# Altium schematic sheet LDO_3V3.SchDoc
size A4; SheetNumber: 4; SheetTotal: 8
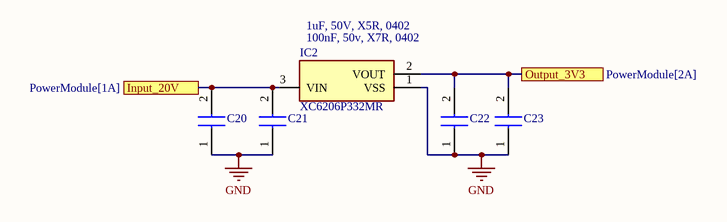
[diagram p0: LDO_3V3.SchDoc]

## Parts
C20  1uF, 50V, X5R, 0402  [GRM15x]  (value not drawn)
C21  100nF, 50v, X7R, 0402  [CAPC2012X88N]  (value not drawn)
C22  100nF, 50v, X7R, 0402  [CAPC2012X88N]  (value not drawn)
C23  1uF, 50V, X5R, 0402  [GRM15x]  (value not drawn)
IC2  XC6206P332MR  [SOT95P280X130-3N]

## Ports
Input_20V (see PowerModule[1A]), Output_3V3 (see PowerModule[2A])

## Nets
GND: C20.1 C21.1 C22.1 C23.1 IC2.1(VSS)
Input_20V: C20.2 C21.2 IC2.3(VIN) ; port Input_20V
Output_3V3: C22.2 C23.2 IC2.2(VOUT) ; port Output_3V3

## Notes on the sheet
- (near IC2) 100nF, 50v, X7R, 0402
- (near IC2) 1uF, 50V, X5R, 0402

## Library data of the parts
C20 C23 = GRM155R61H105KE05J: Capacitor; Manufacturer_Name: Murata Electronics; Datasheet Link: https://search.murata.co.jp/Ceramy/image/img/A01X/G101/ENG/GRM155R61H105KE05-01A.pdf; Height: 0.33mm; Manufacturer_Part_Number: GRM155R61H105KE05J; Mouser Part Number: 81-GRM155R61H105KE5J; Mouser Price/Stock: https://www.mouser.co.uk/ProductDetail/Murata-Electronics/GRM155R61H105KE05J?qs=d0WKAl%252BL4KZilUxqJ3m7lA%3D%3D; Arrow Part Number: GRM155R61H105KE05J; Arrow Price/Stock: https://www.arrow.com/en/products/grm155r61h105ke05j/murata-manufacturing?region=nac
C21 C22 = C0805C104M5RAC: Capacitor; Manufacturer_Name: KEMET; Datasheet Link: https://connect.kemet.com:7667/gateway/IntelliData-ComponentDocumentation/1.0/download/specsheet/C0805C104M5RAC%7bBULK%7d; Height: 0.88mm; Manufacturer_Part_Number: C0805C104M5RAC; Mouser Part Number: 80-C0805C104M5RAC; Mouser Price/Stock: https://www.mouser.co.uk/ProductDetail/KEMET/C0805C104M5RAC?qs=VOOUd%252Bza08rWzt4y8eXMuQ%3D%3D; Arrow Part Number: C0805C104M5RAC; Arrow Price/Stock: https://www.arrow.com/en/products/c0805c104m5rac/kemet-corporation?utm_currency=USD&region=nac
IC2 = XC6206P332MR: Integrated Circuit; Manufacturer_Name: Torex; Datasheet Link: http://www.torexsemi.com/products/voltage_regulators/data/XC6206.pdf; Height: 1.3mm; Manufacturer_Part_Number: XC6206P332MR; Mouser Part Number: N/A; Mouser Price/Stock: https://www.mouser.co.uk/ProductDetail/Torex-Semiconductor/XC6206P332MR?qs=TiOZkKH1s2Qxu69VLzzkSQ%3D%3D